# EAGLE design up-rtr (EAGLE 5.08)
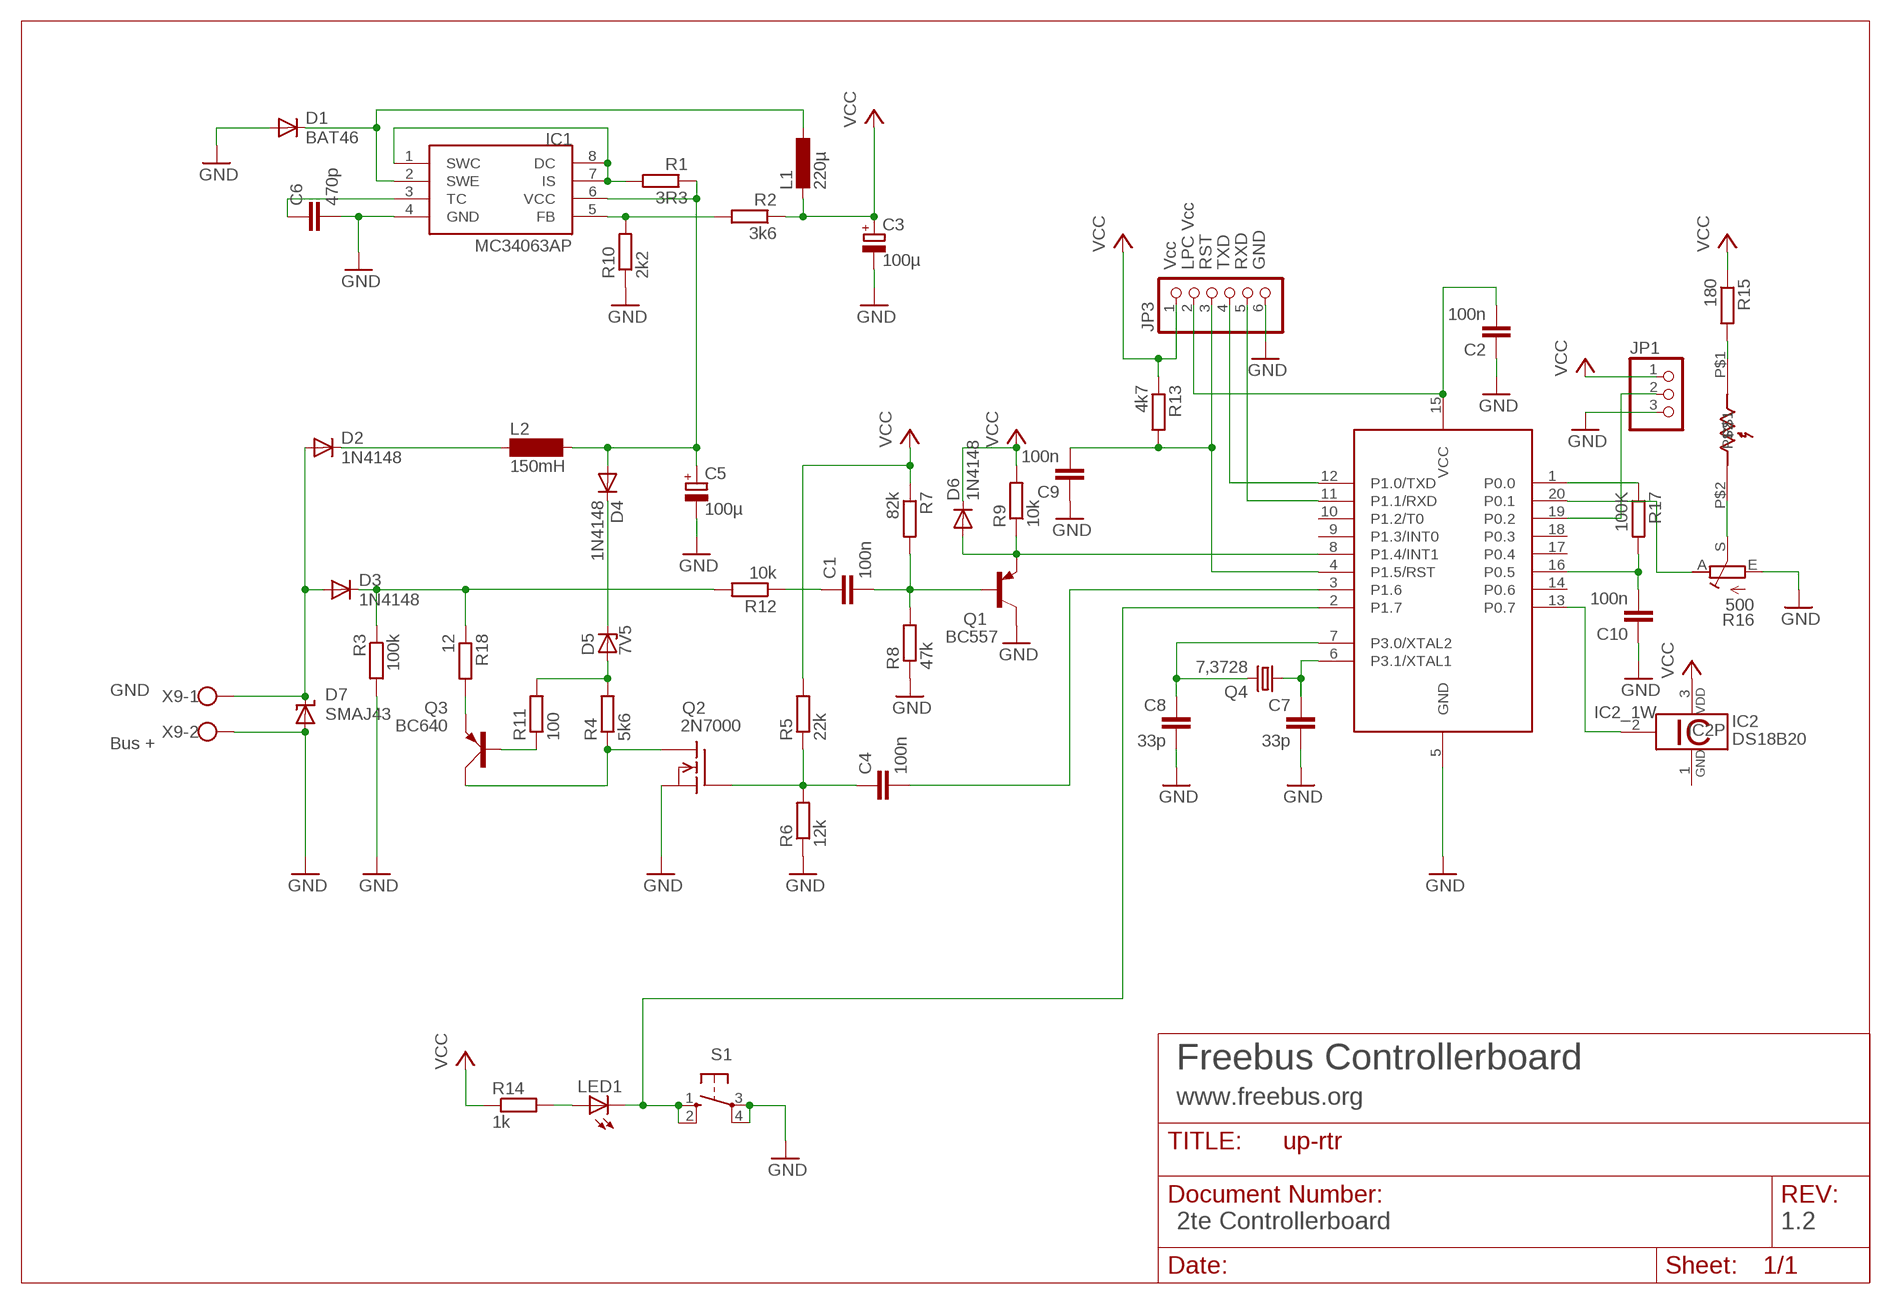
[diagram p0: schematic, sheet 1]

## Parts
89LPC922  89LPC922  [DIL20]
C1  100n  C-EU025-025X050  [C025-025X050]
C2  100n  C-EUC0805  [C0805]
C3  100µ  CPOL-EUE2.5-6  [E2,5-6]
C4  100n  C-EUC0805  [C0805]
C5  100µ  CPOL-EUE3.5-8  [E3,5-8]
C6  470p  C-EUC0805  [C0805]
C7  33p  C-EUC0805  [C0805]
C8  33p  C-EUC0805  [C0805]
C9  100n  C-EUC0805  [C0805]
C10  100n  C-EUC0805  [C0805]
D1  BAT46  BAT81  [DO34-7]
D2  1N4148  1N4148STEHEND  [D-2.5]
D3  1N4148  1N4148STEHEND  [D-2.5]
D4  1N4148  1N4148STEHEND  [D-2.5]
D5  7V5  ZPDSTEHEND  [ZDIODE]
D6  1N4148  1N4148STEHEND  [D-2.5]
D7  SMAJ43  SUPPRESSOR-SMBJ  [SMBJ]
IC1  MC34063AP  [DIL08]
IC2  DS18B20  [TO92-]
JP1  PINHD-1X3  [1X03]
JP3  PINHD-1X6  [1X06]
L1  220µ  L-EU0207/12  [0207/12]
L2  150mH  BS11  [BS11]
LED1  LED3MM  [LED3MM]
Q1  BC557  [TO92]
Q2  2N7000  VN2222KM  [TO237]
Q3  BC640  [SOT54D]
Q4  7,3728  CRYSTALHC49S  [HC49/S]
R1  3R3  R-EU_R0805  [R0805]
R2  3k6  R-EU_0207/2V  [0207/2V]
R3  100k  R-EU_0207/2V  [0207/2V]
R4  5k6  R-EU_R0805  [R0805]
R5  22k  R-EU_R0805  [R0805]
R6  12k  R-EU_R0805  [R0805]
R7  82k  R-EU_0207/2V  [0207/2V]
R8  47k  R-EU_0207/2V  [0207/2V]
R9  10k  R-EU_0207/2V  [0207/2V]
R10  2k2  R-EU_R0805  [R0805]
R11  100  R-EU_R0805  [R0805]
R12  10k  R-EU_0207/2V  [0207/2V]
R13  4k7  R-EU_R0805  [R0805]
R14  1k  R-EU_0207/2V  [0207/2V]
R15  180  R-EU_R0805  [R0805]
R16  500  R-TRIMM-PT6L  [PT6L]
R17  100K  R-EU_R0805  [R0805]
R18  12  R-EU_R0805  [R0805]
RL1  LDR07  [LDR07]
S1  10-XX  [B3F-10XX]
X9  W237-102  [W237-102]

## Nets
/RESET: 89LPC922.4(P1.5/RST) C9.2 JP3.3 R13.2
EIB+: D2.A D3.A D7.C X9.1
FETGATE: C4.1 Q2.2(G) R5.1 R6.2
GND: 89LPC922.5(GND) C2.1 C3.- C5.- C6.2 C7.2 C8.2 C9.1 C10.1 D1.A D7.A IC1.4(GND) JP1.3 JP3.6 Q1.3(C) Q2.3(S) R3.2 R6.1 R8.1 R10.1 R16.E S1.3(P) S1.4(P1) X9.2
N$1: 89LPC922.8(P1.4/INT1) D6.A Q1.1(E) R9.1
N$2: C1.1 R12.1
N$3: 89LPC922.7(P3.0/XTAL2) C8.1 Q4.2
N$4: D3.C R3.1 R12.2 R18.1
N$5: 89LPC922.3(P1.6) C4.2
N$6: 89LPC922.6(P3.1/XTAL1) C7.1 Q4.1
N$7: 89LPC922.2(P1.7) LED1.K(C) S1.1(S) S1.2(S1)
N$8: IC1.1(SWC) IC1.7(IS) IC1.8(DC) R1.2
N$9: LED1.A R14.2
N$10: C5.+ D4.A IC1.6(VCC) L2.2 R1.1
N$11: IC1.5(FB) R2.2 R10.2
N$12: D1.C IC1.2(SWE) L1.1
N$13: D2.C L2.1
N$14: C6.1 IC1.3(TC)
N$15: D4.C D5.C
N$16: R15.2 RL1.P$1
N$17: R16.S RL1.P$2
N$18: 89LPC922.13(P0.7) IC2.2
N$19: 89LPC922.20(P0.1) R16.A
N$20: 89LPC922.1(P0.0) R17.1
N$21: 89LPC922.16(P0.5) C10.2 R17.2
N$22: 89LPC922.19(P0.2) JP1.2
N$24: C1.2 Q1.2(B) R7.2 R8.2
N$25: D5.A R4.2 R11.2
N$26: Q2.1(D) Q3.C R4.1
N$28: Q3.B R11.1
N$29: 89LPC922.12(P1.0/TXD) JP3.4
N$30: 89LPC922.11(P1.1/RXD) JP3.5
N$32: 89LPC922.15(VCC) C2.2 JP3.2
N$33: Q3.E R18.2
VCC: C3.+ D6.C IC2.3 JP1.1 JP3.1 L1.2 R2.1 R5.2 R7.1 R9.2 R13.1 R14.1 R15.1
Unconnected: 89LPC922.9(P1.3/INT0) 89LPC922.10(P1.2/T0) 89LPC922.14(P0.6) 89LPC922.17(P0.4) 89LPC922.18(P0.3)

## Notes on the sheet
- Vcc | LPC Vcc | RST | TXD | RXD | GND
- GND
- Bus +
- Freebus Controllerboard
- www.freebus.org
- 2te Controllerboard | 1.2

## Power pins joined to a net without a drawn wire
GND: IC2.1

## Library data of the parts
89LPC922 = micro-philips:89LPC922
C1 C2 C4 C6-C10 = rcl:C-EU: CAPACITOR, European symbol
C3 C5 = rcl:CPOL-EU: POLARIZED CAPACITOR, European symbol
D1 = diode:BAT81: DIODE barrier diode
D2-D4 D6 = diode:1N4148: DIODE high speed (Philips)
D5 = diode:ZPD: Z DIODE 500 mW
D7 = diode:SUPPRESSOR-: Suppressor diode
IC1 = mc34063:MC34063
IC2 = 1wire:DS18B20: Programmable Resolution Digital Thermometer This chip provides a onewire thermosensor with approx. 0.5°C accuracy. A programmable over/undertemperure alarm is available. The precision can be set from 9..12 bits. Notes: Vdd must be applied for accurate measurements at low temperatures, as the parasite power circuit otherwise heats the sensor. If parasite power is used, Vdd has to be connected to GND. The DS1822 is a low-cost thermometer chip, the DS18S20 is similar to the DS18B20, but with 9 Bit precision only. Author: Jan Kandziora <jjj@gmx.de>
JP1 = pinhead:PINHD-1X3: PIN HEADER
JP3 = pinhead:PINHD-1X6: PIN HEADER
L1 = rcl:L-EU: INDUCTOR, European symbol
L2 = inductor-neosid:BS: INDUCTOR nominal inductance, magnetically screened
LED1 = led:LED: LED OSRAM: - CHIPLED LG R971, LG N971, LY N971, LG Q971, LY Q971, LO R971, LY R971 LH N974, LH R974 LS Q976, LO Q976, LY Q976 LO Q996 - Hyper CHIPLED LW Q18S LB Q993, LB Q99A, LB R99A - SideLED LS A670, LO A670, LY A670, LG A670, LP A670 LB A673, LV A673, LT A673, LW A673 LH A674 LY A675 LS A676, LA A676, LO A676, LY A676, LW A676 LS A679, LY A679, LG A679 - Hyper Micro SIDELED® LS Y876, LA Y876, LO Y876, LY Y876 LT Y87S - SmartLED LW L88C, LW L88S LB L89C, LB L89S, LG L890 LS L89K, LO L89K, LY L89K LS L896, LA L896, LO L896, LY L896 - TOPLED LS T670, LO T670, LY T670, LG T670, LP T670 LSG T670, LSP T670, LSY T670, LOP T670, LYG T670 LG T671, LOG T671, LSG T671 LB T673, LV T673, LT T673, LW T673 LH T674 LS T676, LA T676, LO T676, LY T676, LB T676, LH T676, LSB T676, LW T676 LB T67C, LV T67C, LT T67C, LS T67K, LO T67K, LY T67K, LW E67C LS E67B, LA E67B, LO E67B, LY E67B, LB E67C, LV E67C, LT E67C LW T67C LS T679, LY T679, LG T679 LS T770, LO T770, LY T770, LG T770, LP T770 LB T773, LV T773, LT T773, LW T773 LH T774 LS E675, LA E675, LY E675, LS T675 LS T776, LA T776, LO T776, LY T776, LB T776 LHGB T686 LT T68C, LB T68C - Hyper Mini TOPLED® LB M676 - Mini TOPLED Santana® LG M470 LS M47K, LO M47K, LY M47K Source: http://www.osram.convergy.de - LUMILED® LXK2-PW12-R00, LXK2-PW12-S00, LXK2-PW14-U00, LXK2-PW14-V00 LXK2-PM12-R00, LXK2-PM12-S00, LXK2-PM14-U00 LXK2-PE12-Q00, LXK2-PE12-R00, LXK2-PE12-S00, LXK2-PE14-T00, LXK2-PE14-U00 LXK2-PB12-K00, LXK2-PB12-L00, LXK2-PB12-M00, LXK2-PB14-N00, LXK2-PB14-P00, LXK2-PB14-Q00 LXK2-PR12-L00, LXK2-PR12-M00, LXK2-PR14-Q00, LXK2-PR14-R00 LXK2-PD12-Q00, LXK2-PD12-R00, LXK2-PD12-S00 LXK2-PH12-R00, LXK2-PH12-S00 LXK2-PL12-P00, LXK2-PL12-Q00, LXK2-PL12-R00 Source: www.luxeon.com
Q1 = transistor-pnp:BC557: PNP Transistor
Q2 = transistor-fet:VN2222KM: N-Channel Enhancement MOSFET (VMOS); 60V; 0,5A; 7,5Ohm
Q3 = transistor-small-signal:BC640: PNP TRANSISTOR
Q4 = crystal:CRYSTAL: CRYSTAL
R1-R15 R17 R18 = rcl:R-EU_: RESISTOR, European symbol
R16 = kubi:R-TRIMM
RL1 = ldr:LDR07
S1 = switch-omron:10-XX: OMRON SWITCH
X9 = con-wago-500:W237-102: WAGO SCREW CLAMP

## Board
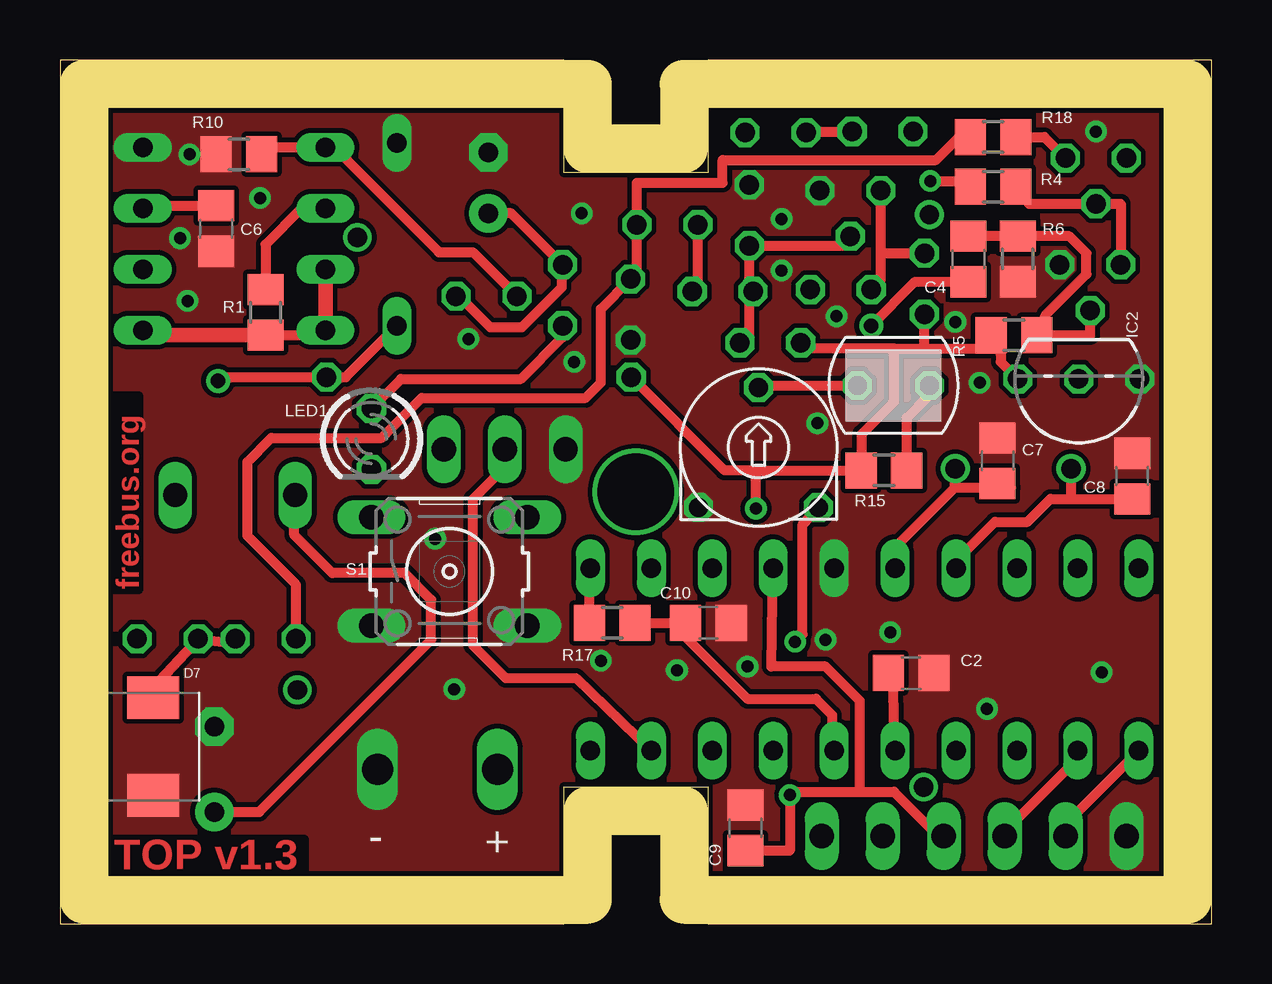
[diagram p1: board, top side]
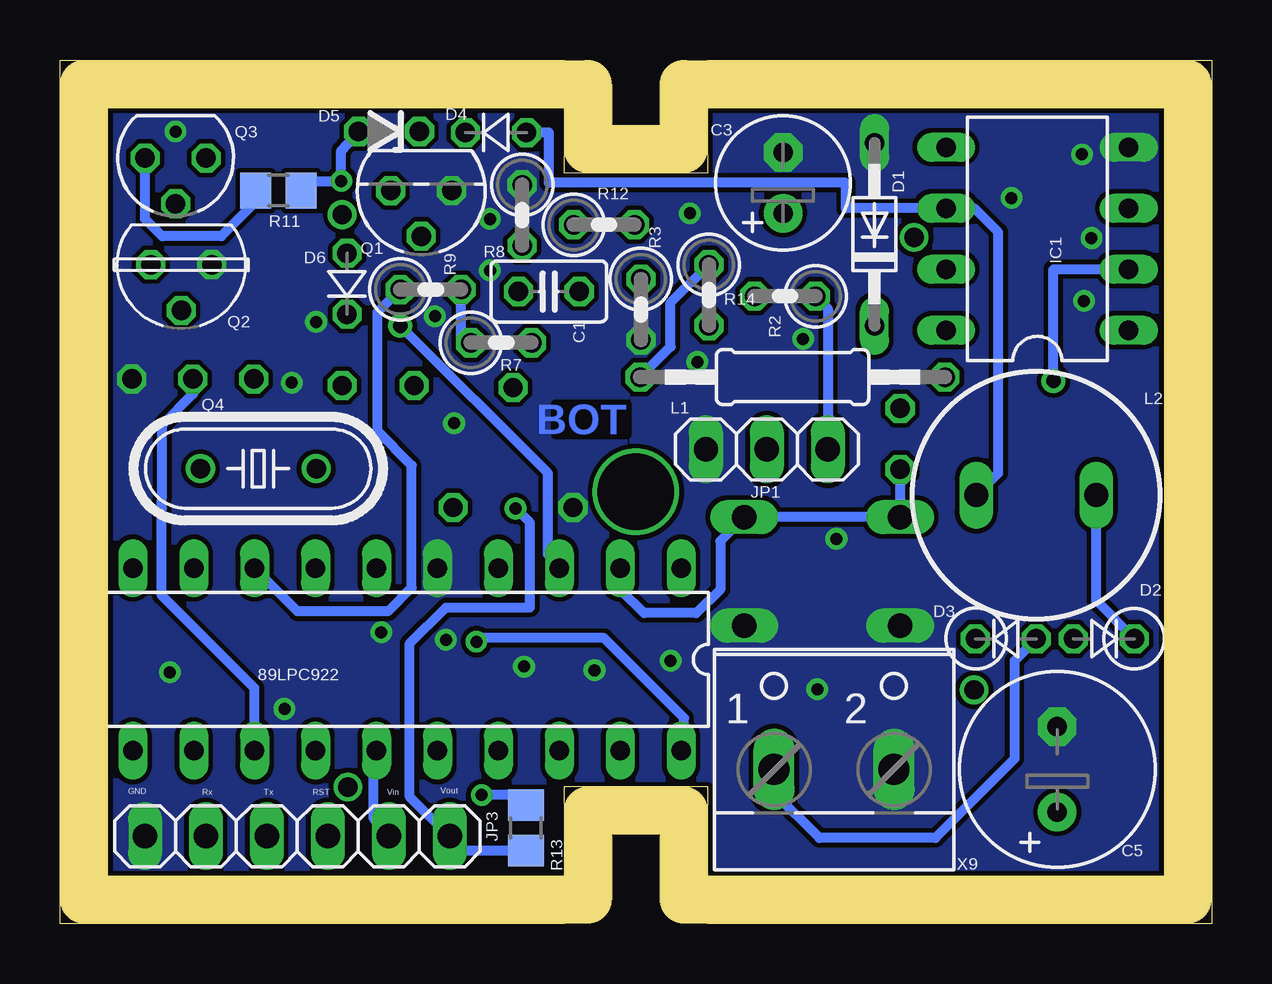
[diagram p2: board, bottom side, seen from below]

Size 48 x 36 mm. Coordinates in mm from the lower left corner, seen from the top.
Outline: 0,0 21,0 21,5.7 27,5.7 27,0 48,0 48,36 27,36 27,31.3 21,31.3 21,36 0,36 0,0
Outline: 1,1 22,1 22,4.7 26,4.7 26,1 47,1 47,35 26,35 26,32.3 22,32.3 22,35 1,35 1,1
Copper layers (1*16): Top 0.035mm / dielectric 1.5mm / Bottom 0.035mm
Design rules "ZWILLING": minimum track width 0.2mm, minimum drill 0.5mm, track to track 0.2mm, track to pad 0.2mm, pad to pad 0.15mm, via to via 0.2mm, smd to smd 0mil, copper to edge 0.2mm, drill to drill 0.2mm, minimum pad ring 0.2mm, minimum via ring 0.2mm, stop-mask expansion 0.1mm, vias tented up to drill 0mil, thermal gap 10mil

### Footprints (pad centres in the part's own frame; a part is rotated, then mirrored left to right if it is on the bottom)
DIL20@1 = drill 0.813 long: 1 -11.43,-3.81; 2 -8.89,-3.81; 3 -6.35,-3.81; 4 -3.81,-3.81; 5 -1.27,-3.81; 6 1.27,-3.81; 7 3.81,-3.81; 8 6.35,-3.81; 9 8.89,-3.81; 10 11.43,-3.81; 11 11.43,3.81; 12 8.89,3.81; 13 6.35,3.81; 14 3.81,3.81; 15 1.27,3.81; 16 -1.27,3.81; 17 -3.81,3.81; 18 -6.35,3.81; 19 -8.89,3.81; 20 -11.43,3.81
C025-025X050 = drill 0.813 octagon: 1 -1.27,0; 2 1.27,0
C0805 = smd 1.3 x 1.5: 1 -0.95,0; 2 0.95,0
E2,5-6 = drill 0.813 pad 1.6 round: + -1.27,0 | drill 0.813 pad 1.6 octagon: - 1.27,0
E3,5-8 = drill 0.813 pad 1.6 round: + -1.778,0 | drill 0.813 pad 1.6 octagon: - 1.778,0
DO34-7 = drill 0.813 long: A 3.81,0; C -3.81,0
D-2.5 = drill 0.813 octagon: A 1.27,0; C -1.27,0
ZDIODE = drill 0.813 octagon: A 1.27,0; C -1.27,0
SMBJ = smd 1.78 x 2.16: A 2.04,0; C -2.03,0
DIL08 = drill 0.813 long: 1 -3.81,-3.81; 2 -1.27,-3.81; 3 1.27,-3.81; 4 3.81,-3.81; 5 3.81,3.81; 6 1.27,3.81; 7 -1.27,3.81; 8 -3.81,3.81
TO92- = drill 0.813 octagon: 1 -2.54,0; 2 0,0; 3 2.54,0
1X03 = drill 1.016 long: 1 -2.54,0; 2 0,0; 3 2.54,0
1X06 = drill 1.016 long: 1 -6.35,0; 2 -3.81,0; 3 -1.27,0; 4 1.27,0; 5 3.81,0; 6 6.35,0
0207/12 = drill 0.813 octagon: 1 -6.35,0; 2 6.35,0
BS11 = drill 1 long: 1 -2.5,0; 2 2.5,0
LED3MM = drill 0.813 octagon: A -1.27,0; K 1.27,0
TO92 = drill 0.813 octagon: 1 1.27,0; 2 0,1.905; 3 -1.27,0
TO237 = drill 0.813 octagon: 1 1.27,0; 2 0,1.905; 3 -1.27,0
SOT54D = drill 0.813 octagon: B 1.27,0; C 0,1.905; E -1.27,0
HC49/S = drill 0.813 round: 1 -2.413,0; 2 2.413,0
R0805 = smd 1.3 x 1.5: 1 -0.95,0; 2 0.95,0
0207/2V = drill 0.813 octagon: 1 -1.27,0; 2 1.27,0
PT6L = drill 0.8 octagon: A 2.5,2.5; E 2.5,-2.5; S -2.5,0
LDR07 = drill 0.8 octagon: P$1 -1.5,0; P$2 1.5,0
B3F-10XX = drill 1.016 long: 1 -3.251,2.261; 2 3.251,2.261; 3 -3.251,-2.261; 4 3.251,-2.261
W237-102 = drill 1.3 long: 1 -2.5,-1.27; 2 2.5,-1.27

### Placement (x,y rotation side)
89LPC922  89LPC922  [DIL20@1]  33.54,11.01 180 bottom
C1  27.62,26.35 180 bottom
C2  35.48,10.44 180 top
C3  17.86,30.88 90 bottom
C4  37.86,27.7 270 top
C5  6.43,6.43 90 bottom
C6  6.51,28.97 270 top
C7  39.08,19.29 90 top
C8  44.69,18.65 90 top
C9  28.57,3.99 270 top
C10  27.03,12.54 180 top
D1  14.05,28.73 90 bottom
D2  4.48,11.87 180 bottom
D3  8.57,11.87 0 bottom
D4  29.83,32.98 0 bottom
D5  34.29,33.02 180 bottom
D6  36.04,26.67 90 bottom
D7  3.89,7.38 270 top
IC1  7.26,28.54 90 bottom
IC2  42.47,22.7 180 top
JP1  18.53,19.76 180 bottom
JP3  38.11,3.64 180 bottom
L1  17.46,22.78 180 bottom
L2  7.31,17.86 180 bottom
LED1  12.98,20.2 270 top
Q1  32.94,30.56 180 bottom
Q2  42.94,27.46 180 bottom
Q3  43.18,31.91 180 bottom
Q4  39.73,18.96 180 bottom
R1  8.57,25.48 270 top
R2  17.78,26.15 180 bottom
R3  23.79,25.6 270 bottom
R4  38.89,30.72 180 top
R5  39.76,24.53 180 top
R6  39.93,27.7 90 top
R7  29.61,24.21 0 bottom
R8  28.73,29.53 270 bottom
R9  32.54,26.43 0 bottom
R10  7.46,32.07 0 top
R11  38.89,30.56 0 bottom
R12  25.32,29.13 0 bottom
R13  28.58,3.99 90 bottom
R14  20.95,26.19 270 bottom
R15  34.34,18.89 0 top
R16  29.12,19.84 270 top
R17  23.02,12.54 0 top
R18  38.89,32.78 0 top
RL1  34.75,22.43 180 top
S1  16.23,14.68 0 top
X9  15.74,7.69 0 bottom

### Tracks (layer width: path | path; a pad name or v marks a point on that pad's centre or on a via)
/RESET  (via drill 0.5)
  Top 0.406: 89LPC922.4 29.65,10.72 31.91,10.72 33.34,9.29 33.34,5.5 | 33.34,5.5 34.76,5.5 36.6,3.66 JP3.3 | 33.34,5.5 30.53,5.5 v30.42,5.36 30.42,3.04 C9.2
  Bottom 0.406: v30.42,5.36 28.97,5.36 R13.2
EIB+
  Top 0.406: D3.A 7.3,11.67 D2.A 3.89,9.84 D7.C
  Bottom 0.406: X9.1 18.24,5.46 16.35,3.57 11.51,3.57 8.21,6.87 8.21,10.95 D3.A
FETGATE
  Top 0.406: Q2.2 42.94,24.53 R5.1 41.11,25.4 42.78,27.07 42.78,27.94 42.07,28.65 R6.2 C4.1
GND  (via drill 0.5)
  other vias: 22.54,10.95 31.57,20.86 8.33,30.24 43.18,33.02 38.34,22.54 38.64,8.95 34.61,12.14 30.08,29.37 43.42,10.48 21.43,23.42 17.03,24.37 21.75,29.61 5.4,32.07 15.64,16.03 32.37,25.32 16.43,9.76 31.91,11.83 25.72,10.56 28.65,10.72 5.32,25.96 5,28.57 37.32,25.08 30.08,27.23
  pour Bottom (no thermals): -0.06,36.03 47.98,36.03 47.98,0 0,0
  pour Top (no thermals): 47.98,36.03 47.98,0 0,0 0,36.03
N$1
  Top 0.406: R9.1 34.21,26.83 34.21,27.94 | 34.21,27.94 Q1.1 | 34.21,27.94 D6.A
  Bottom 0.406: 89LPC922.8 39.89,14.8 38.1,13.02 34.33,13.02 33.34,14.01 33.34,19.1 34.77,20.53 34.77,25.48 R9.1
N$2
  Top 0.406: C1.1 26.59,26.35 R12.1
N$3
  Top 0.406: 89LPC922.7 37.27,15.04 38.97,16.75 40.33,16.75 41.28,17.7 42.07,17.7 | 42.07,17.7 C8.1 | Q4.2 42.15,17.78 42.07,17.7
N$4
  Top 0.406: R18.1 37.47,32.78 36.52,31.83 27.62,31.83 27.62,30.88 24.05,30.88 R12.2 24.05,27.13 R3.1 22.54,25.62 22.54,22.54 21.91,21.91 15.08,21.91 13.41,20.24 8.81,20.24 7.81,19.24 7.81,16.16 9.84,14.13 D3.C
N$5  (via drill 0.6)
  Top 0.406: C4.2 35.64,26.75 v33.81,24.92
  Bottom 0.406: 89LPC922.3 27.66,15.4 27.66,18.77 v33.81,24.92
N$6
  Top 0.406: 89LPC922.6 34.73,15.6 37.31,18.18 | 37.31,18.18 39.64,18.18 C7.1 | 37.31,18.18 37.31,18.95 Q4.1
N$7
  Bottom 0.406: 89LPC922.2 24.57,13.85 23.65,12.94 21.47,12.94 20.48,13.93 20.48,15.95 S1.2 S1.1 LED1.K
N$8
  Top 0.406: IC1.8 10.87,24.53 R1.2
  Top 0.61: IC1.8 IC1.7 | R1.2 3.88,24.53 IC1.1
N$9
  Top 0.406: LED1.A 14.21,22.7 19.21,22.7 20.95,24.45 R14.2
N$10
  Top 0.406: R1.1 8.57,28.31 10.08,29.81 IC1.6 | C5.+ 8.3,4.65 15.48,11.83 15.48,13.49 14.37,14.61 11.35,14.61 9.76,16.19 9.76,17.81 L2.2
  Bottom 0.406: L2.2 8.89,18.78 8.89,28.81 9.89,29.81 IC1.6 15.24,29.81 15.24,30.88 27.62,30.88 27.62,32.98 D4.A
N$11
  Top 0.406: R10.2 8.7,32.35 IC1.5 11.42,32.35 15.8,27.98 17.22,27.98 R2.2
N$12  (via drill 0.6)
  Top 0.406: D1.C 11.91,22.78 L1.1 6.75,22.78 v6.59,22.62
  Bottom 0.406: v6.59,22.62 6.59,27.27 IC1.2
N$13
  Bottom 0.406: D2.C 4.81,13.46 L2.1
N$14
  Top 0.406: C6.1 3.72,29.92 IC1.3
N$15
  Top 0.406: D5.C 31.14,33.02 D4.C
N$16
  Top 0.406: R15.2 35.29,21.08 36.2,21.99 36.2,22.43 RL1.P$1
N$17
  Top 0.406: RL1.P$2 29.09,22.43 R16.S
N$18
  Bottom 0.406: 89LPC922.13 39.89,9.8 43.76,13.67 43.76,17.3 43.75,18.1 43.75,20.78 42.47,22.07 IC2.2
N$19  (via drill 0.5)
  Top 0.406: v30.64,11.75 30.96,12.06 30.96,16.64 R16.A
  Bottom 0.406: v30.64,11.75 30.48,11.91 25.32,11.91 21.99,8.57 21.99,7.26 89LPC922.20
N$20
  Top 0.406: R17.1 22.07,14.76 89LPC922.1
N$21
  Top 0.406: 89LPC922.16 32.19,7.46 32.19,8.69 31.51,9.37 28.65,9.37 25.64,12.38 C10.2 24.01,12.54 R17.2
N$22
  Top 0.406: 89LPC922.19 21.51,10.24 18.57,10.24 17.22,11.59 17.22,17.7 18.69,19.17 JP1.2
N$23  (via drill 3.2)
  other vias: 24,18
N$24
  Top 0.406: Q1.2 32.94,28.26 R8.2 28.73,26.35 | R7.2 28.73,24.21 28.73,26.35 | 28.73,26.35 C1.2
N$25  (via drill 0.5)
  Top 0.406: R4.2 R11.2 37.94,30.96 v36.27,30.96
  Bottom 0.406: D5.A 36.27,32.23 v36.27,30.96 37.71,30.96 R11.2
N$26
  Top 0.406: Q2.1 44.21,30 Q3.C 40.4,30 R4.1
N$28
  Bottom 0.406: Q3.B 44.45,29.37 43.74,28.65 41.27,28.65 39.84,30.09 R11.1
N$29
  Top 0.406: 89LPC922.12 42.35,6.8 39.37,3.83 JP3.4
N$30
  Top 0.406: 89LPC922.11 44.89,7.12 41.89,4.12 41.89,3.62 JP3.5
N$32
  Top 0.406: 89LPC922.15 34.73,10.4 C2.2
  Bottom 0.406: JP3.2 34.33,3.78 34.92,4.37 34.92,7.2 89LPC922.15
N$33
  Top 0.406: Q3.E 41.04,32.78 R18.2
N$34  (via drill 0.8)
  other vias: 9.9,9.74
N$35  (via drill 0.8)
  other vias: 36,5.69
N$36  (via drill 0.8)
  other vias: 12.4,28.6
N$37  (via drill 0.8)
  other vias: 36.24,29.56
VCC  (via drill 0.5)
  Top 0.406: 29.01,18.89 R15.1 33.42,18.92 33.42,20.4 34.77,21.75 34.77,23.97 | v29.01,17.3 29.01,18.89 | 29.01,18.89 27.7,18.89 L1.2 | IC2.3 39.21,23.41 39.21,23.73 | 39.21,23.73 R5.2 | 34.77,23.97 31.11,23.97 R7.1 | 34.77,23.97 36.04,23.97 | 36.04,23.97 39.21,23.97 39.21,23.73 | 36.04,23.97 D6.C | 36.04,23.97 | C3.+ 18.81,29.61 R14.1 20.91,27.42 20.91,26.51 19.25,24.84 17.94,24.84 16.63,26.15 R2.1
  Bottom 0.406: R13.1 31.15,3.04 JP3.1 33.42,5.29 33.42,11.67 31.91,13.18 28.42,13.18 28.42,16.71 v29.01,17.3 | R7.1 31.27,24.21 R9.2 | L1.2 22.54,24.05 22.54,25.88 R14.1 | JP1.1 16,25.64 R2.1

### Text on the board
Top: freebus.org | TOP v1.3
Bottom: BOT
tPlace: - | +
bPlace: Vout | Vin | RST | Tx | Rx | GND